# EAGLE design TestBench_rev2 (EAGLE 6.1)
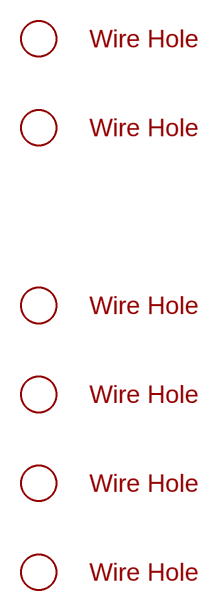
[diagram p0: schematic, sheet 1, part 1 of 2]
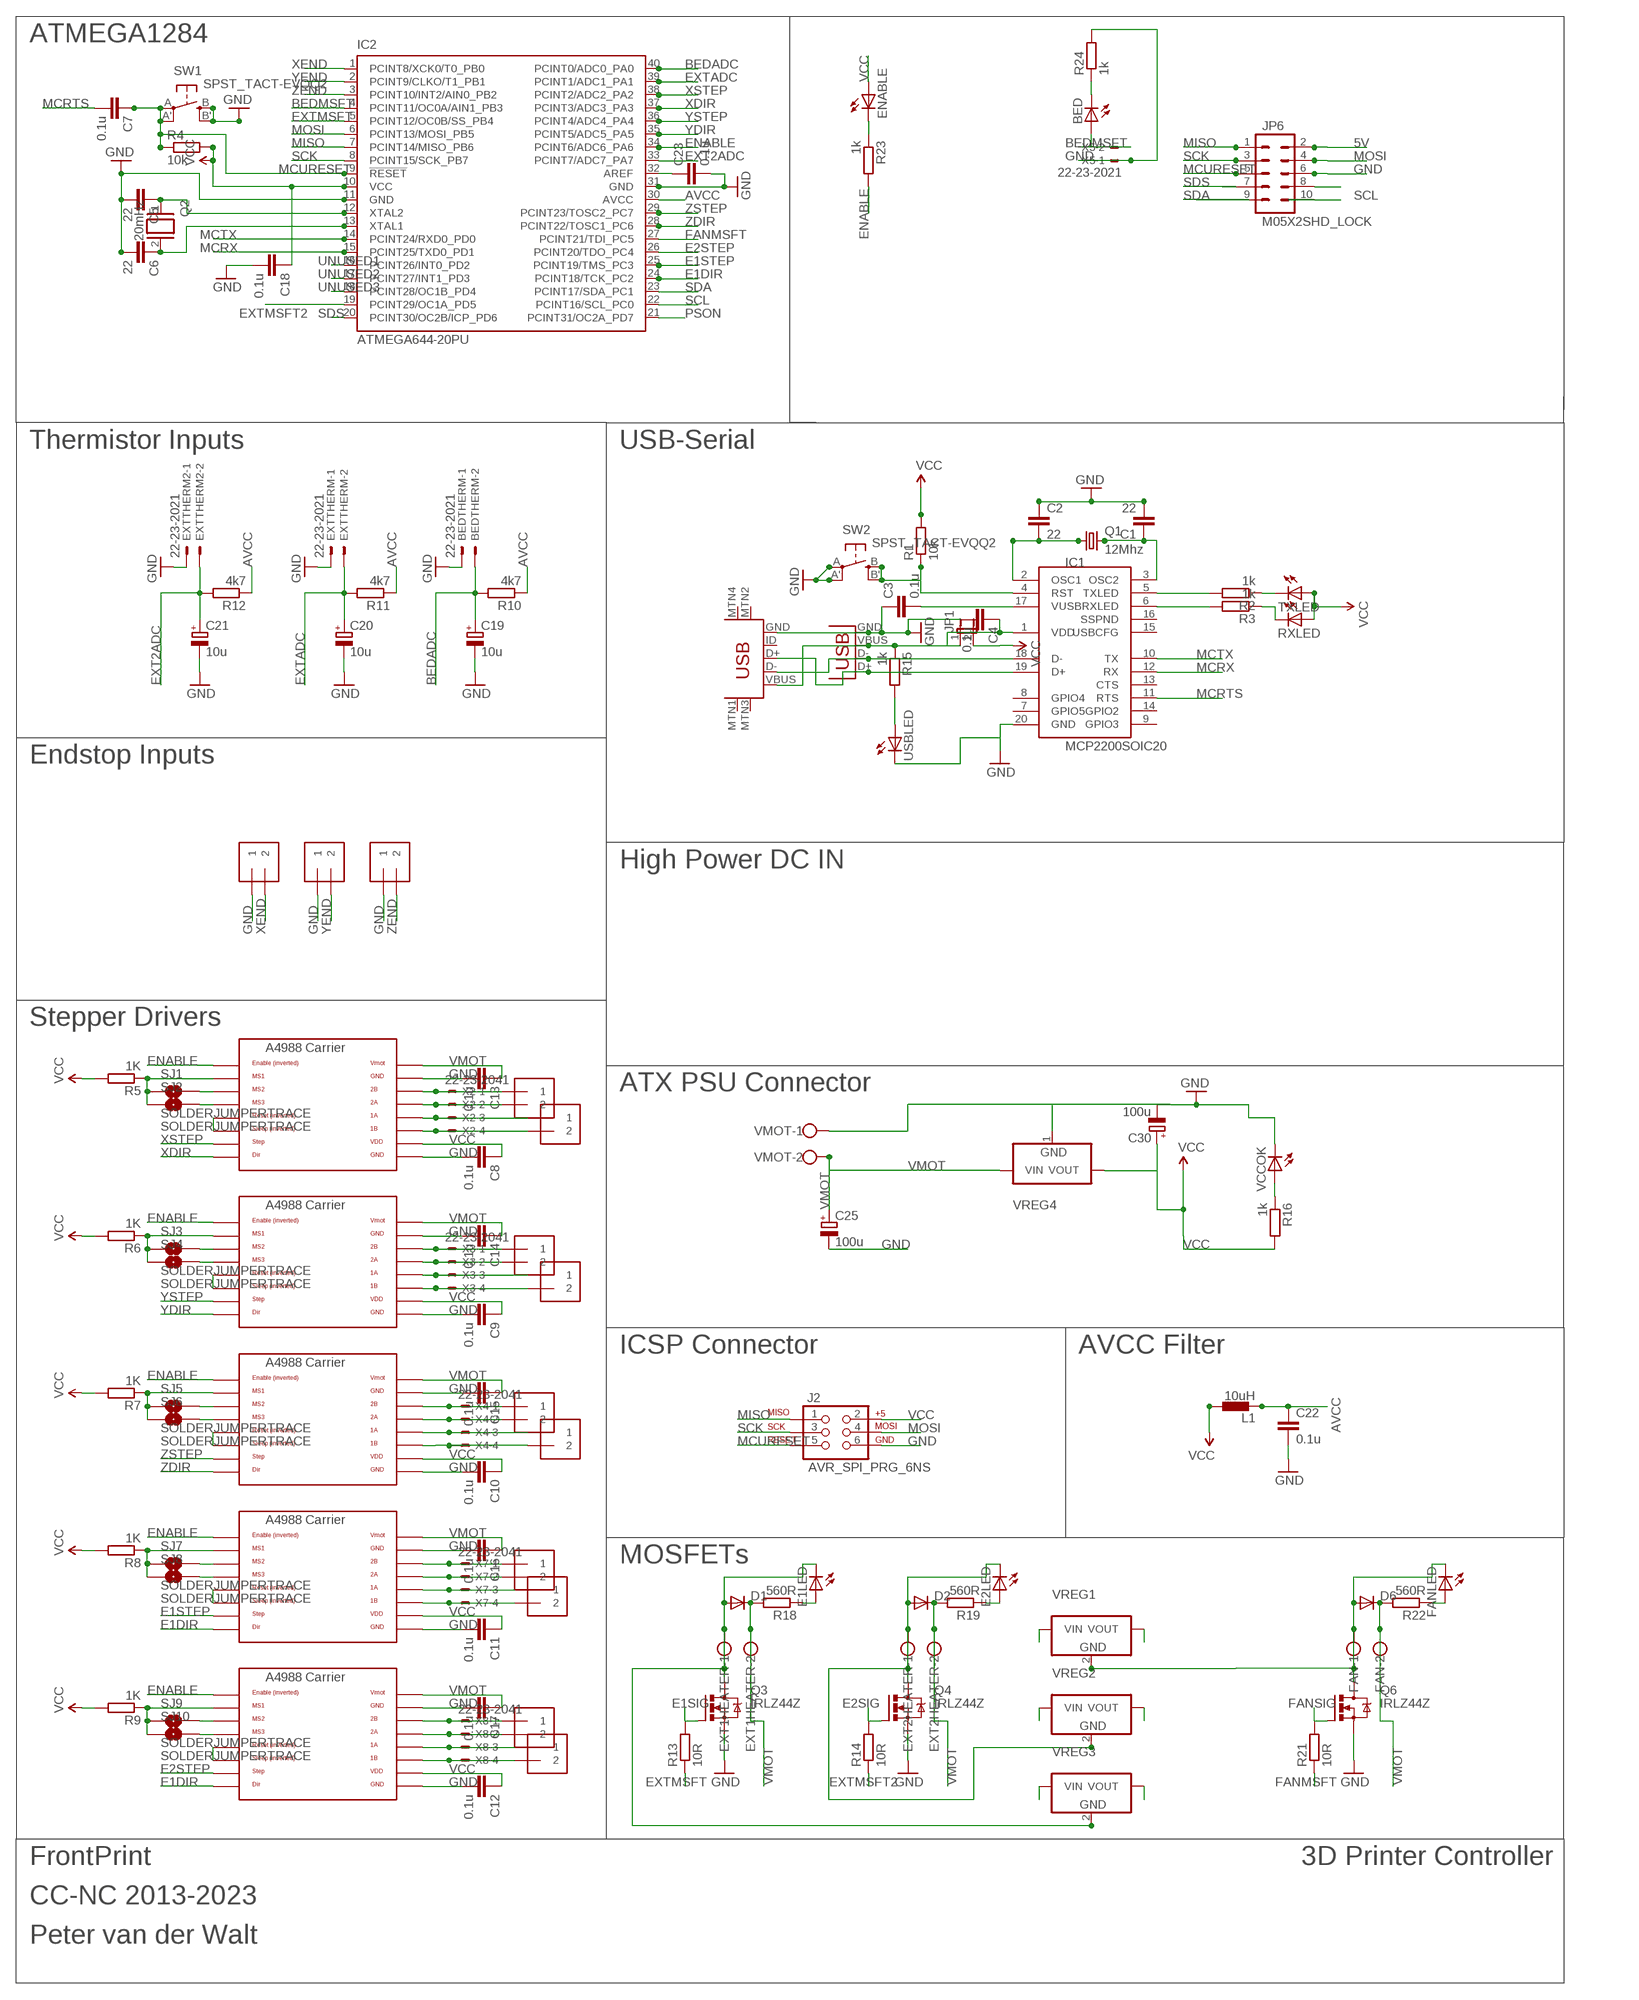
[diagram p1: schematic, sheet 1, part 2 of 2]

## Parts
BED  LEDSMT1206  [1206]
BEDTHERM  22-23-2021  [22-23-2021]
C1  22  CAP1206  [1206]
C2  22  CAP1206  [1206]
C3  0.1u  CAP1206  [1206]
C4  0.1u  CAP1206  [1206]
C5  22  CAPKIT  [CAP-PTH-SMALL-KIT]
C6  22  CAPKIT  [CAP-PTH-SMALL-KIT]
C7  0.1u  CAP1206  [1206]
C8  0.1u  CAP1206  [1206]
C9  0.1u  CAP1206  [1206]
C10  0.1u  CAP1206  [1206]
C11  0.1u  CAP1206  [1206]
C12  0.1u  CAP1206  [1206]
C13  0.1u  CAP1206  [1206]
C14  0.1u  CAP1206  [1206]
C15  0.1u  CAP1206  [1206]
C16  0.1u  CAP1206  [1206]
C17  0.1u  CAP1206  [1206]
C18  0.1u  CAP1206  [1206]
C19  10u  CPOL-EUE2.5-5  [E2,5-5]
C20  10u  CPOL-EUE2.5-5  [E2,5-5]
C21  10u  CPOL-EUE2.5-5  [E2,5-5]
C22  0.1u  CAP1206  [1206]
C23  0.1u  CAP1206  [1206]
C25  100u  CPOL-EUE5-8.5  [E5-8,5]
C30  100u  CPOL-EUE5-8.5  [E5-8,5]
D1  DIODE1N4148  [DIODE-1N4148]
D2  DIODE1N4148  [DIODE-1N4148]
D6  DIODE1N4148  [DIODE-1N4148]
E1LED  LEDSMT1206  [1206]
E1MOT1  1X2-3.5MM  [1X2-3.5MM]
E1MOT2  1X2-3.5MM  [1X2-3.5MM]
E2LED  LEDSMT1206  [1206]
E2MOT1  1X2-3.5MM  [1X2-3.5MM]
E2MOT2  1X2-3.5MM  [1X2-3.5MM]
ENABLE  LEDSMT1206  [1206]
EPOLOLU  POLOLU_A4983CARRIER  [A4988BREAKOUT]
EPOLOLU2  POLOLU_A4983CARRIER  [A4988BREAKOUT]
EXT1HEATER  W237-102  [W237-102]
EXT2HEATER  W237-102  [W237-102]
EXTTHERM  22-23-2021  [22-23-2021]
EXTTHERM2  22-23-2021  [22-23-2021]
FAN  W237-102  [W237-102]
FANLED  LEDSMT1206  [1206]
IC1  MCP2200SOIC20  [SOIC20]
IC2  ATMEGA644-20PU  [DIL40]
J2  AVR_SPI_PRG_6NS  [2X3-NS]
JP1  JUMPER-2PTH_LOCK  [1X02_LOCK]
JP6  M05X2SHD_LOCK  [2X5-SHROUDED_LOCK]
L1  10uH  BL01RN1A  [BL01RN1A]
Q1  12Mhz  CRYSTALHC49UP  [HC49UP]
Q2  20mHz  XTAL/S  [QS]
Q3  IRLZ44Z  [TO220BH]
Q4  IRLZ44Z  [TO220BH]
Q6  IRLZ44Z  [TO220BH]
R1  10k  R-EU_M1206  [M1206]
R2  1k  R-EU_M1206  [M1206]
R3  1k  R-EU_M1206  [M1206]
R4  10k  R-EU_M1206  [M1206]
R5  1K  R-EU_M1206  [M1206]
R6  1K  R-EU_M1206  [M1206]
R7  1K  R-EU_M1206  [M1206]
R8  1K  R-EU_M1206  [M1206]
R9  1K  R-EU_M1206  [M1206]
R10  4k7  R-EU_M1206  [M1206]
R11  4k7  R-EU_M1206  [M1206]
R12  4k7  R-EU_M1206  [M1206]
R13  10R  R-EU_M1206  [M1206]
R14  10R  R-EU_M1206  [M1206]
R15  1k  R-EU_M1206  [M1206]
R16  1k  R-EU_M1206  [M1206]
R18  560R  R-EU_M1206  [M1206]
R19  560R  R-EU_M1206  [M1206]
R21  10R  R-EU_M1206  [M1206]
R22  560R  R-EU_M1206  [M1206]
R23  1k  R-EU_M1206  [M1206]
R24  1k  R-EU_M1206  [M1206]
RXLED  LEDSMT1206  [1206]
SJ1  SOLDERJUMPERTRACE  [SJ_2S-TRACE]
SJ2  SOLDERJUMPERTRACE  [SJ_2S-TRACE]
SJ3  SOLDERJUMPERTRACE  [SJ_2S-TRACE]
SJ4  SOLDERJUMPERTRACE  [SJ_2S-TRACE]
SJ5  SOLDERJUMPERTRACE  [SJ_2S-TRACE]
SJ6  SOLDERJUMPERTRACE  [SJ_2S-TRACE]
SJ7  SOLDERJUMPERTRACE  [SJ_2S-TRACE]
SJ8  SOLDERJUMPERTRACE  [SJ_2S-TRACE]
SJ9  SOLDERJUMPERTRACE  [SJ_2S-TRACE]
SJ10  SOLDERJUMPERTRACE  [SJ_2S-TRACE]
SW1  SPST_TACT-EVQQ2  [EVQ-Q2]
SW2  SPST_TACT-EVQQ2  [EVQ-Q2]
TXLED  LEDSMT1206  [1206]
U$1  3MMHOLE  [3MMHOLE]
U$2  USB-MINIB-5PIN  [USB-MINIB]
U$3  3MMHOLE  [3MMHOLE]
U$5  3MMHOLE  [3MMHOLE]
U$6  3MMHOLE  [3MMHOLE]
U$7  3MMHOLE  [3MMHOLE]
U$8  3MMHOLE  [3MMHOLE]
USBLED  LEDSMT1206  [1206]
VCCOK  LEDSMT1206  [1206]
VMOT  W237-102  [W237-102]
VREG1  VREG_3PINS-D2PAK  [D2PAK]
VREG2  VREG_3PINS-D2PAK  [D2PAK]
VREG3  VREG_3PINS-D2PAK  [D2PAK]
VREG4  VREG_3PINS-DPAK  [DPAK]
X1  USBPTH  [USB-B-PTH]
X2  22-23-2041  [22-23-2041]
X3  22-23-2041  [22-23-2041]
X4  22-23-2041  [22-23-2041]
X5  22-23-2021  [22-23-2021]
X7  22-23-2041  [22-23-2041]
X8  22-23-2041  [22-23-2041]
XEND  1X2-3.5MM  [1X2-3.5MM]
XMOT1  1X2-3.5MM  [1X2-3.5MM]
XMOT2  1X2-3.5MM  [1X2-3.5MM]
XPOLOLU  POLOLU_A4983CARRIER  [A4988BREAKOUT]
YEND  1X2-3.5MM  [1X2-3.5MM]
YMOT1  1X2-3.5MM  [1X2-3.5MM]
YMOT2  1X2-3.5MM  [1X2-3.5MM]
YPOLOLU  POLOLU_A4983CARRIER  [A4988BREAKOUT]
ZEND  1X2-3.5MM  [1X2-3.5MM]
ZMOT1  1X2-3.5MM  [1X2-3.5MM]
ZMOT2  1X2-3.5MM  [1X2-3.5MM]
ZPOLOLU  POLOLU_A4983CARRIER  [A4988BREAKOUT]

## Nets
5V: JP6.2
AVCC: C22.1 IC2.30(AVCC) L1.1 R10.1 R11.1 R12.1
BEDADC: BEDTHERM.2 C19.+ IC2.40(PCINT0/ADC0_PA0) R10.2
BEDMSFT: BED.A IC2.4(PCINT11/OC0A/AIN1_PB3) X5.2
E1DIR: EPOLOLU2.DIR EPOLOLU.DIR IC2.24(PCINT18/TCK_PC2)
E1SIG: Q3.G R13.2 VREG3.1(VIN)
E1STEP: EPOLOLU.STEP IC2.25(PCINT19/TMS_PC3)
E2SIG: Q4.G R14.2 VREG2.1(VIN)
E2STEP: EPOLOLU2.STEP IC2.26(PCINT20/TDO_PC4)
ENABLE: EPOLOLU2.EN EPOLOLU.EN IC2.34(PCINT6/ADC6_PA6) R23.2 XPOLOLU.EN YPOLOLU.EN ZPOLOLU.EN
EXT2ADC: C21.+ EXTTHERM2.2 IC2.33(PCINT7/ADC7_PA7) R12.2
EXTADC: C20.+ EXTTHERM.2 IC2.39(PCINT1/ADC1_PA1) R11.2
EXTMSFT: IC2.5(PCINT12/OC0B/SS_PB4) R13.1
EXTMSFT2: IC2.19(PCINT29/OC1A_PD5) R14.1
FANMSFT: IC2.27(PCINT21/TDI_PC5) R21.1
FANSIG: Q6.G R21.2 VREG1.1(VIN)
GND: BEDTHERM.1 C1.2 C2.1 C3.1 C4.2 C5.2 C6.2 C8.2 C9.2 C10.2 C11.2 C12.2 C13.2 C14.2 C15.2 C16.2 C17.2 C18.2 C19.- C20.- C21.- C22.2 C23.2 C25.- C30.- EPOLOLU2.GND EPOLOLU2.GND@0(GND) EPOLOLU.GND EPOLOLU.GND@0(GND) EXTTHERM2.1 EXTTHERM.1 IC1.20(GND) IC2.11(GND) IC2.31(GND) J2.6 JP6.6 Q3.S Q4.S Q6.S R24.2 SW1.B'(S1) SW1.B(S) SW2.A'(P1) SW2.A(P) U$2.GND USBLED.C VCCOK.C VMOT.1 VREG1.3(VOUT) VREG2.3(VOUT) VREG3.3(VOUT) VREG4.1(GND) X1.GND X5.1 XEND.1 XPOLOLU.GND XPOLOLU.GND@0(GND) YEND.1 YPOLOLU.GND YPOLOLU.GND@0(GND) ZEND.1 ZPOLOLU.GND ZPOLOLU.GND@0(GND)
MCRTS: C7.2 IC1.11(RTS)
MCRX: IC1.12(RX) IC2.15(PCINT25/TXD0_PD1)
MCTX: IC1.10(TX) IC2.14(PCINT24/RXD0_PD0)
MCURESET: C7.1 IC2.9(!RESET) J2.5 JP6.5 R4.1 SW1.A'(P1) SW1.A(P)
MISO: IC2.7(PCINT14/MISO_PB6) J2.1 JP6.1
MOSI: IC2.6(PCINT13/MOSI_PB5) J2.4 JP6.4
N$1: C2.2 IC1.2(OSC1) Q1.1
N$2: C1.1 IC1.3(OSC2) Q1.2
N$3: IC1.5(TXLED) R2.2
N$4: IC1.18(D-) U$2.D- X1.D-
N$5: IC1.19(D+) U$2.D+ X1.D+
N$6: IC1.6(RXLED) R3.2
N$7: C3.2 IC1.17(VUSB)
N$9: R2.1 TXLED.C
N$10: R3.1 RXLED.C
N$11: C5.1 IC2.12(XTAL2) Q2.1
N$12: C6.1 IC2.13(XTAL1) Q2.2
N$13: IC1.4(RST) R1.1 SW2.B'(S1) SW2.B(S)
N$14: R7.1 SJ5.1 SJ6.1 ZPOLOLU.MS1
N$15: SJ6.2 ZPOLOLU.MS3
N$16: SJ5.2 ZPOLOLU.MS2
N$17: EPOLOLU.MS2 SJ7.2
N$18: EPOLOLU.MS3 SJ8.2
N$19: EPOLOLU.MS1 R8.1 SJ7.1 SJ8.1
N$20: SJ3.2 YPOLOLU.MS2
N$21: SJ4.2 YPOLOLU.MS3
N$22: R6.1 SJ3.1 SJ4.1 YPOLOLU.MS1
N$23: SJ1.2 XPOLOLU.MS2
N$24: SJ2.2 XPOLOLU.MS3
N$25: R5.1 SJ1.1 SJ2.1 XPOLOLU.MS1
N$26: XPOLOLU.RST XPOLOLU.SLP(SLEEP)
N$27: YPOLOLU.RST YPOLOLU.SLP(SLEEP)
N$28: ZPOLOLU.RST ZPOLOLU.SLP(SLEEP)
N$29: EPOLOLU.RST EPOLOLU.SLP(SLEEP)
N$30: E1MOT1.1 EPOLOLU.2B X7.1
N$31: E1MOT1.2 EPOLOLU.2A X7.2
N$32: E1MOT2.1 EPOLOLU.1A X7.3
N$33: E1MOT2.2 EPOLOLU.1B X7.4
N$34: X4.4 ZMOT2.2 ZPOLOLU.1B
N$35: X4.3 ZMOT2.1 ZPOLOLU.1A
N$36: X4.2 ZMOT1.2 ZPOLOLU.2A
N$37: X4.1 ZMOT1.1 ZPOLOLU.2B
N$38: X3.4 YMOT2.2 YPOLOLU.1B
N$39: X3.3 YMOT2.1 YPOLOLU.1A
N$40: X3.2 YMOT1.2 YPOLOLU.2A
N$41: X3.1 YMOT1.1 YPOLOLU.2B
N$42: X2.4 XMOT2.2 XPOLOLU.1B
N$43: X2.3 XMOT2.1 XPOLOLU.1A
N$44: X2.2 XMOT1.2 XPOLOLU.2A
N$45: X2.1 XMOT1.1 XPOLOLU.2B
N$46: EPOLOLU2.MS2 SJ9.2
N$47: EPOLOLU2.MS3 SJ10.2
N$48: EPOLOLU2.MS1 R9.1 SJ9.1 SJ10.1
N$49: EPOLOLU2.RST EPOLOLU2.SLP(SLEEP)
N$50: E2MOT1.1 EPOLOLU2.2B X8.1
N$51: E2MOT1.2 EPOLOLU2.2A X8.2
N$52: E2MOT2.1 EPOLOLU2.1A X8.3
N$53: E2MOT2.2 EPOLOLU2.1B X8.4
N$54: C23.1 IC2.32(AREF)
N$55: D1.A E1LED.C EXT1HEATER.1 Q3.D VREG3.2(GND)
N$56: D2.A E2LED.C EXT2HEATER.1 Q4.D VREG2.2(GND)
N$58: C4.1 IC1.1(VDD) JP1.1 R15.1 U$2.VBUS X1.VBUS
N$59: BED.C R24.1
N$61: E1LED.A R18.1
N$64: R16.1 VCCOK.A
N$66: E2LED.A R19.1
N$67: D6.A FAN.1 FANLED.C Q6.D VREG1.2(GND)
N$68: R15.2 USBLED.A
N$69: FANLED.A R22.1
N$71: ENABLE.C R23.1
N$73: JP6.8
PSON: IC2.21(PCINT31/OC2A_PD7)
SCK: IC2.8(PCINT15/SCK_PB7) J2.3 JP6.3
SCL: IC2.22(PCINT16/SCL_PC0) JP6.10
SDA: IC2.23(PCINT17/SDA_PC1) JP6.9
SDS: IC2.20(PCINT30/OC2B/ICP_PD6) JP6.7
UNUSED1: IC2.16(PCINT26/INT0_PD2)
UNUSED2: IC2.17(PCINT27/INT1_PD3)
UNUSED3: IC2.18(PCINT28/OC1B_PD4)
VCC: C8.1 C9.1 C10.1 C11.1 C12.1 C18.1 C30.+ ENABLE.A EPOLOLU2.VDD EPOLOLU.VDD IC2.10(VCC) J2.2 JP1.2 L1.2 R1.2 R4.2 R5.2 R6.2 R7.2 R8.2 R9.2 R16.2 RXLED.A TXLED.A VREG4.2(VOUT) XPOLOLU.VDD YPOLOLU.VDD ZPOLOLU.VDD
VMOT: C13.1 C14.1 C15.1 C16.1 C17.1 C25.+ D1.C D2.C D6.C EPOLOLU2.VMOT EPOLOLU.VMOT EXT1HEATER.2 EXT2HEATER.2 FAN.2 R18.2 R19.2 R22.2 VMOT.2 VREG4.3(VIN) XPOLOLU.VMOT YPOLOLU.VMOT ZPOLOLU.VMOT
XDIR: IC2.37(PCINT3/ADC3_PA3) XPOLOLU.DIR
XEND: IC2.1(PCINT8/XCK0/T0_PB0) XEND.2
XSTEP: IC2.38(PCINT2/ADC2_PA2) XPOLOLU.STEP
YDIR: IC2.35(PCINT5/ADC5_PA5) YPOLOLU.DIR
YEND: IC2.2(PCINT9/CLKO/T1_PB1) YEND.2
YSTEP: IC2.36(PCINT4/ADC4_PA4) YPOLOLU.STEP
ZDIR: IC2.28(PCINT22/TOSC1_PC6) ZPOLOLU.DIR
ZEND: IC2.3(PCINT10/INT2/AIN0_PB2) ZEND.2
ZSTEP: IC2.29(PCINT23/TOSC2_PC7) ZPOLOLU.STEP
Unconnected: IC1.7(GPIO5) IC1.8(GPIO4) IC1.9(GPIO3) IC1.13(CTS) IC1.14(GPIO2) IC1.15(USBCFG) IC1.16(SSPND) U$2.ID U$2.MTN1(MTN2) U$2.MTN2(MTN3) U$2.MTN3(MTN1) U$2.MTN4

## Notes on the sheet
- ATMEGA1284
- Thermistor Inputs | USB-Serial
- Endstop Inputs
- High Power DC IN
- Stepper Drivers
- ATX PSU Connector
- ICSP Connector | AVCC Filter
- MOSFETs
- FrontPrint | 3D Printer Controller
- CC-NC 2013-2023
- Peter van der Walt

## Library data of the parts
BED E1LED E2LED ENABLE FANLED RXLED TXLED USBLED VCCOK = led:LED: LED OSRAM: - CHIPLED LG R971, LG N971, LY N971, LG Q971, LY Q971, LO R971, LY R971 LH N974, LH R974 LS Q976, LO Q976, LY Q976 LO Q996 - Hyper CHIPLED LW Q18S LB Q993, LB Q99A, LB R99A - SideLED LS A670, LO A670, LY A670, LG A670, LP A670 LB A673, LV A673, LT A673, LW A673 LH A674 LY A675 LS A676, LA A676, LO A676, LY A676, LW A676 LS A679, LY A679, LG A679 - Hyper Micro SIDELED® LS Y876, LA Y876, LO Y876, LY Y876 LT Y87S - SmartLED LW L88C, LW L88S LB L89C, LB L89S, LG L890 LS L89K, LO L89K, LY L89K LS L896, LA L896, LO L896, LY L896 - TOPLED LS T670, LO T670, LY T670, LG T670, LP T670 LSG T670, LSP T670, LSY T670, LOP T670, LYG T670 LG T671, LOG T671, LSG T671 LB T673, LV T673, LT T673, LW T673 LH T674 LS T676, LA T676, LO T676, LY T676, LB T676, LH T676, LSB T676, LW T676 LB T67C, LV T67C, LT T67C, LS T67K, LO T67K, LY T67K, LW E67C LS E67B, LA E67B, LO E67B, LY E67B, LB E67C, LV E67C, LT E67C LW T67C LS T679, LY T679, LG T679 LS T770, LO T770, LY T770, LG T770, LP T770 LB T773, LV T773, LT T773, LW T773 LH T774 LS E675, LA E675, LY E675, LS T675 LS T776, LA T776, LO T776, LY T776, LB T776 LHGB T686 LT T68C, LB T68C - Hyper Mini TOPLED® LB M676 - Mini TOPLED Santana® LG M470 LS M47K, LO M47K, LY M47K Source: http://www.osram.convergy.de LUXEON: - LUMILED® LXK2-PW12-R00, LXK2-PW12-S00, LXK2-PW14-U00, LXK2-PW14-V00 LXK2-PM12-R00, LXK2-PM12-S00, LXK2-PM14-U00 LXK2-PE12-Q00, LXK2-PE12-R00, LXK2-PE12-S00, LXK2-PE14-T00, LXK2-PE14-U00 LXK2-PB12-K00, LXK2-PB12-L00, LXK2-PB12-M00, LXK2-PB14-N00, LXK2-PB14-P00, LXK2-PB14-Q00 LXK2-PR12-L00, LXK2-PR12-M00, LXK2-PR14-Q00, LXK2-PR14-R00 LXK2-PD12-Q00, LXK2-PD12-R00, LXK2-PD12-S00 LXK2-PH12-R00, LXK2-PH12-S00 LXK2-PL12-P00, LXK2-PL12-Q00, LXK2-PL12-R00 Source: www.luxeon.com KINGBRIGHT: KA-3528ASYC Source: www.kingbright.com
BEDTHERM EXTTHERM EXTTHERM2 X5 = con-molex:22-23-2021: .100" (2.54mm) Center Header - 2 Pin; MF: MOLEX; MPN: 22-23-2021; OC_FARNELL: 1462926; OC_NEWARK: 25C3832
C1-C18 C22 C23 = SparkFun-Passives:CAP: Capacitor Standard 0603 ceramic capacitor, and 0.1" leaded capacitor.
C19-C21 C25 C30 = rcl:CPOL-EU: POLARIZED CAPACITOR, European symbol
D1 D2 D6 = SparkFun-DiscreteSemi:DIODE: Diode These are standard reverse protection diodes and small signal diodes. SMA package can handle up to about 1A. SOD-323 can handle about 200mA. What the SOD-323 package when ordering, there are some mfgs out there that are 5-pin packages.
E1MOT1 E1MOT2 E2MOT1 E2MOT2 XEND XMOT1 XMOT2 YEND YMOT1 YMOT2 ZEND ZMOT1 ZMOT2 = adafruit:1X2: 3.5mm Terminal block http://www.ladyada.net/library/pcb/eaglelibrary.html
EPOLOLU EPOLOLU2 XPOLOLU YPOLOLU ZPOLOLU = RepRapjr:POLOLU_A4983CARRIER
EXT1HEATER EXT2HEATER FAN VMOT = con-wago-500:W237-102: WAGO SCREW CLAMP; MPN: 237-102; OC_FARNELL: unknown; OC_NEWARK: 70K9898
IC1 = microchip-update-2:MCP2200: USB 2.0 to UART Protocol Converter with GPIO
IC2 = atmel:ATMEGA644-*PU: 8-bit Microcontroller with 64K Bytes In-System Programmable Flash Auto generated by make-symbol-device-package-bsdl.ulp Rev. 34 Source: http://www.atmel.com/dyn/resources/prod_documents/doc2593.pdf; MPN: ATMEGA644-20PU; OC_FARNELL: 1288340; OC_NEWARK: 23M5060
J2 = SparkFun-Connectors:AVR_SPI_PRG_6: AVR ISP 6 Pin This is the reduced ISP connector for AVR programming. Common on Arduino. This footprint will take up less PCB space and can be used with a 10-pin to 6-pin adapter such as SKU: BOB-08508
JP1 = SparkFun-Passives:JUMPER-2: Jumper Basic 0.1" spaced jumper. Use with breakaway headers.
JP6 = SparkFun-Connectors:M05X2: Header 5x2 Standard 10-pin dual row 0.1" header. Commonly used with AVR-ISP. Use with Spark Fun Electronics SKU: PRT-00778
L1 = inductors:BL0: Noise Suppression Products/EMI Suppression Filters, Lead EMIFIL(R) Inductor Type Source: http://www.murata.com .. BL01RN1_DS.pdf
Q1 = adafruit:CRYSTAL: CRYSTAL; OC_FARNELL: unknown; OC_NEWARK: unknown
Q2 = special:XTAL/S: CRYSTAL
Q3 Q4 Q6 = transistor-power:IRLZ44Z: N-Channel HEXFET® Power MOSFET Logic Level AUTOMOTIVE MOSFET Source: http://www.irf.com/product-info/datasheets/data/irlz44zpbf.pdf
R1-R16 R18 R19 R21-R24 = resistor:R-EU_: RESISTOR, European symbol
SJ1-SJ10 = SparkFun-Passives:SOLDERJUMPER: Solder Jumper Standard SMD solder jumper. Used to automate production. Two varients : Normally Open and Normally Closed are the same, but have different paste layers. NC will have a large amount of paste and should jumper during reflow.
SW1 SW2 = adafruit:SPST_TACT: SMT 6mm switch, EVQQ2 series http://www.ladyada.net/library/eagle
U$1 U$3 U$5-U$8 = reprap:3MMHOLE
U$2 = SparkFun-Connectors:USB-MINIB: Mini-USB "B" connector with 5th pin broken out. Created new symbol breaking out 5th "ID" pin in mini/micro USB connector spec. See: http://en.wikipedia.org/wiki/Mini_usb#Cables. Uses same footprint as 4-pin symbol. Also added pins to connect to mounting / shield pads if required (probably not generally needed as signals aren't shielded once they leave the connector).
VREG1-VREG4 = dp_devices:VREG_3PINS: Various 3 pin voltage regulators in different packages Double check the right pinout for the right part
X1 = SparkFun-Connectors:USB: USB Connectors USB-B-PTH is fully proven SKU : PRT-00139 USB-miniB is fully proven SKU : PRT-00587 USB-A-PCB is untested. USB-A-H is throughly reviewed, but untested. Spark Fun Electronics SKU : PRT-00437 USB-B-SMT is throughly reviewed, but untested. Needs silkscreen touching up. USB-A-S has not been used/tested USB-MB-H has not been used/tested
X2-X4 X7 X8 = con-molex:22-23-2041: .100" (2.54mm) Center Header - 4 Pin; MF: MOLEX; MPN: 22-23-2041; OC_FARNELL: 1462920; OC_NEWARK: 38C0355

## Board
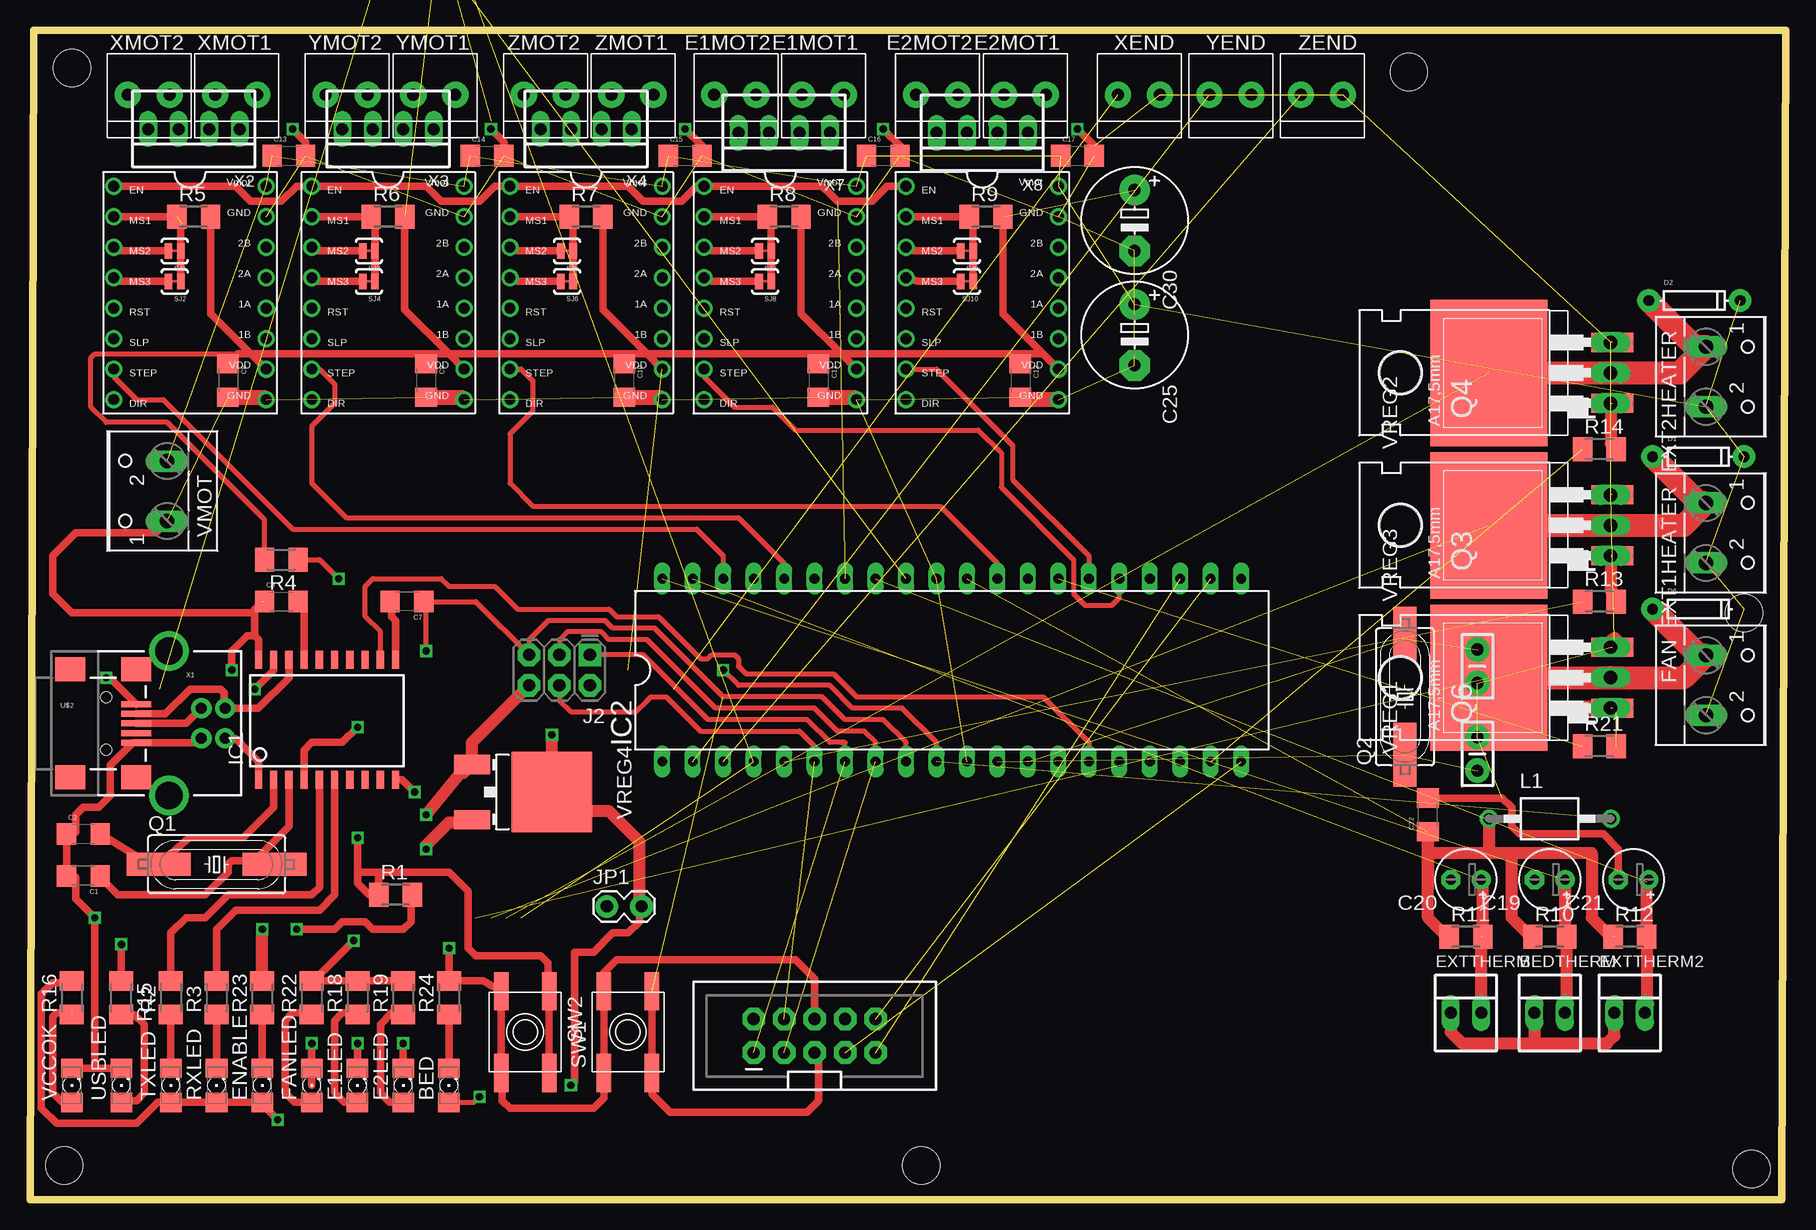
[diagram p2: board, top side]
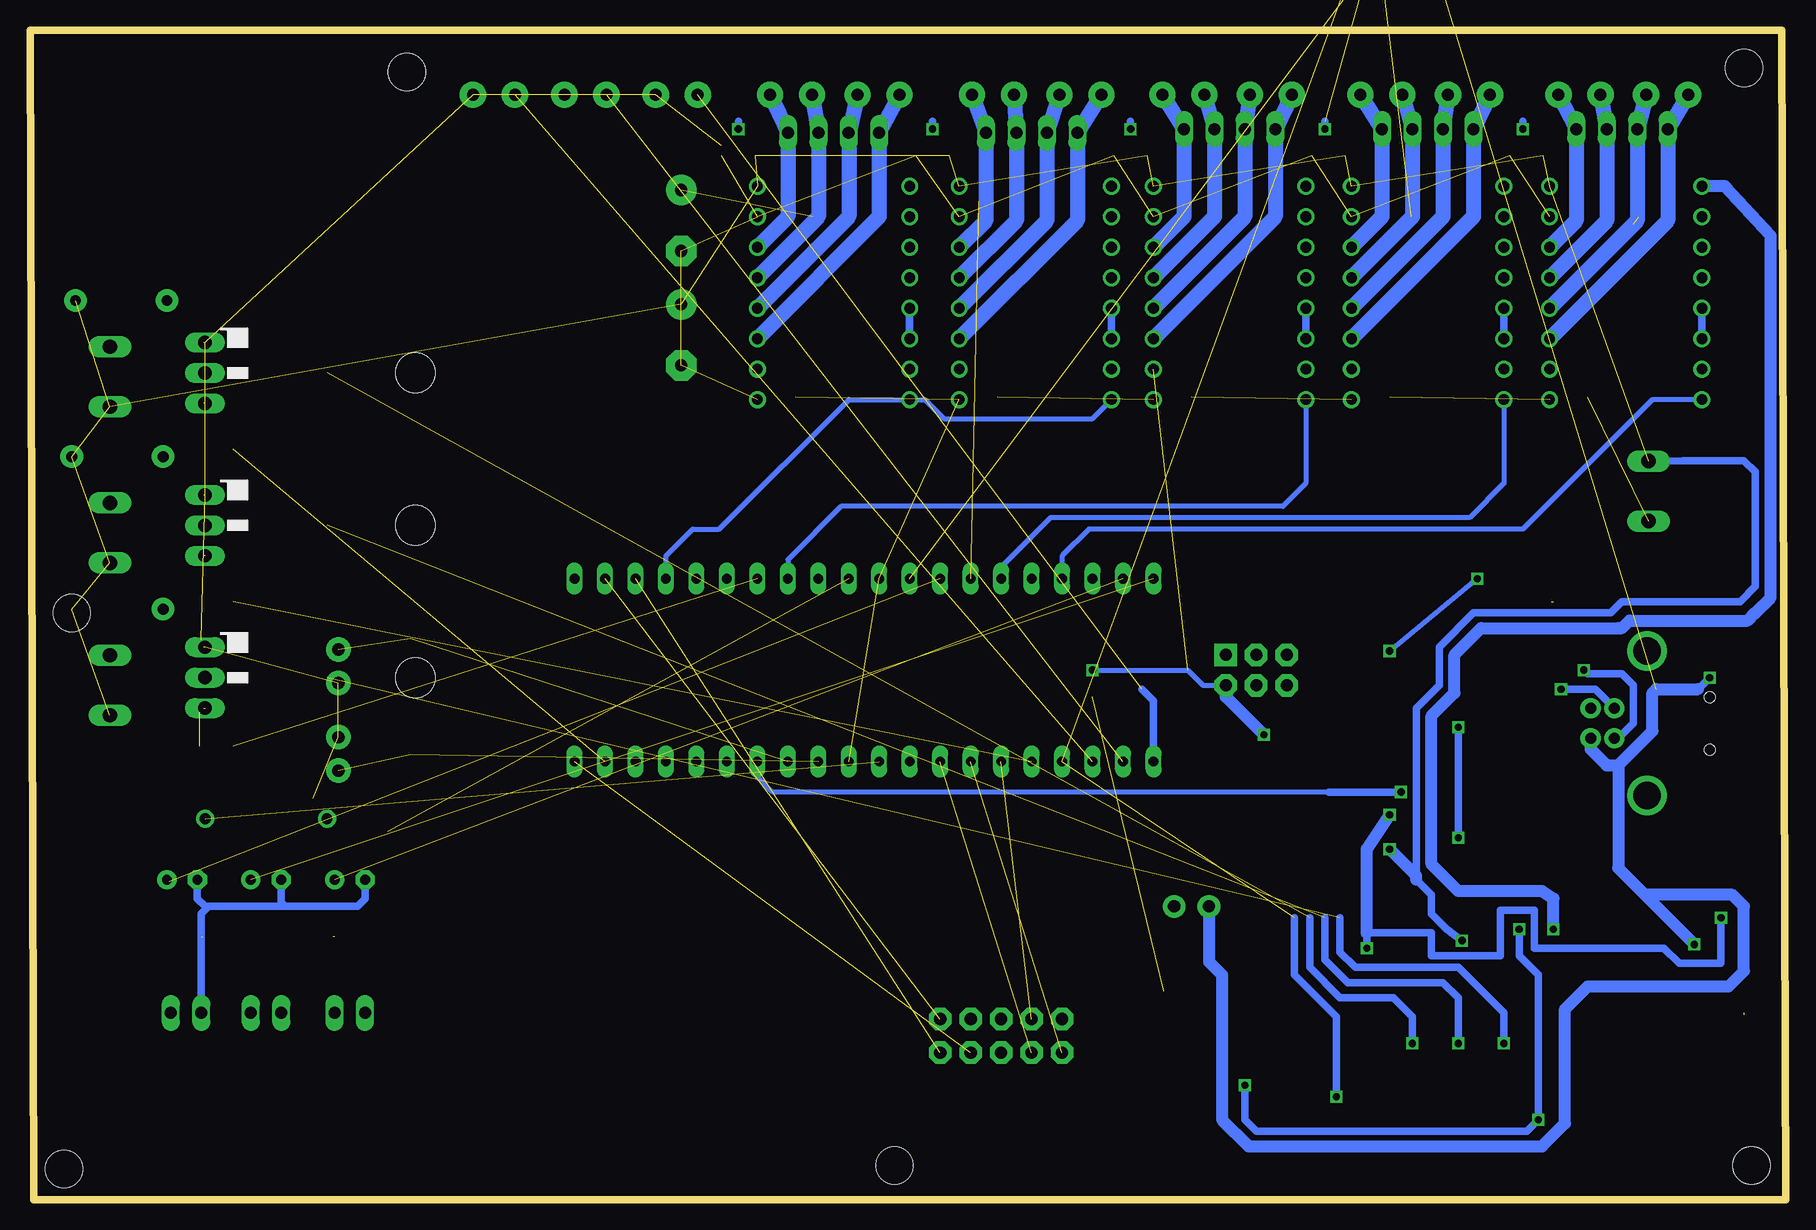
[diagram p3: board, bottom side, seen from below]

Size 146.35 x 97.47 mm. Coordinates in mm from the lower left corner, seen from the top.
Outline: 146.35,97.46 146.04,0 0,0 0.32,97.46 146.35,97.46
Outline: 146.35,97.46 100.65,97.47
Copper layers (1*16): Top 0.035mm / dielectric 1.5mm / Bottom 0.035mm
Design rules: minimum track width 10mil, minimum drill 24mil, track to track 8mil, track to pad 8mil, pad to pad 8mil, via to via 8mil, smd to smd 8mil, copper to edge 40mil, drill to drill 8mil, minimum pad ring 10mil, minimum via ring 8mil, stop-mask expansion 4mil, vias tented up to drill 0mil, thermal gap 10mil

### Footprints (pad centres in the part's own frame; a part is rotated, then mirrored left to right if it is on the bottom)
1206 = smd 1.6 x 1.803: A -1.422,0; C 1.422,0
22-23-2021 = drill 1 long: 1 -1.27,0; 2 1.27,0
1206' = smd 1.6 x 1.8: 1 -1.4,0; 2 1.4,0
CAP-PTH-SMALL-KIT = drill 1.016 pad 2.032: 1 -1.397,0; 2 1.397,0
E2,5-5 = drill 0.813 pad 1.6: + -1.27,0 | drill 0.813 pad 1.6 octagon: - 1.27,0
E5-8,5 = drill 1.016 pad 2.54: + -2.54,0 | drill 1.016 pad 2.54 octagon: - 2.54,0
DIODE-1N4148 = drill 0.9 pad 1.88: A -3.81,0; C 3.81,0
1X2-3.5MM = drill 1 pad 2.184: 1 1.8,0; 2 -1.7,0
A4988BREAKOUT = drill 0.9: 1A 8.89,1.27; 1B 11.43,1.27; 2A 6.35,1.27; 2B 3.81,1.27; DIR 16.51,-11.43; EN -1.27,-11.43; GND 16.51,1.27; GND@0 1.27,1.27; MS1 1.27,-11.43; MS2 3.81,-11.43; MS3 6.35,-11.43; RST 8.89,-11.43; SLP 11.43,-11.43; STEP 13.97,-11.43; VDD 13.97,1.27; VMOT -1.27,1.27
W237-102 = drill 1.194 long: 1 -2.5,-1.27; 2 2.5,-1.27
SOIC20 = smd 0.6 x 1.5: 1 -5.715,-5; 2 -4.445,-5; 3 -3.175,-5; 4 -1.905,-5; 5 -0.635,-5; 6 0.635,-5; 7 1.905,-5; 8 3.175,-5; 9 4.445,-5; 10 5.715,-5; 11 5.715,5; 12 4.445,5; 13 3.175,5; 14 1.905,5; 15 0.635,5; 16 -0.635,5; 17 -1.905,5; 18 -3.175,5; 19 -4.445,5; 20 -5.715,5
DIL40 = drill 0.813 long: 1 -24.13,-7.62; 2 -21.59,-7.62; 3 -19.05,-7.62; 4 -16.51,-7.62; 5 -13.97,-7.62; 6 -11.43,-7.62; 7 -8.89,-7.62; 8 -6.35,-7.62; 9 -3.81,-7.62; 10 -1.27,-7.62; 11 1.27,-7.62; 12 3.81,-7.62; 13 6.35,-7.62; 14 8.89,-7.62; 15 11.43,-7.62; 16 13.97,-7.62; 17 16.51,-7.62; 18 19.05,-7.62; 19 21.59,-7.62; 20 24.13,-7.62; 21 24.13,7.62; 22 21.59,7.62; 23 19.05,7.62; 24 16.51,7.62; 25 13.97,7.62; 26 11.43,7.62; 27 8.89,7.62; 28 6.35,7.62; 29 3.81,7.62; 30 1.27,7.62; 31 -1.27,7.62; 32 -3.81,7.62; 33 -6.35,7.62; 34 -8.89,7.62; 35 -11.43,7.62; 36 -13.97,7.62; 37 -16.51,7.62; 38 -19.05,7.62; 39 -21.59,7.62; 40 -24.13,7.62
2X3-NS = drill 1.016 pad 1.88 square: 1 -2.54,-1.27 | drill 1.016 pad 1.88 octagon: 2 -2.54,1.27; 3 0,-1.27; 4 0,1.27; 5 2.54,-1.27; 6 2.54,1.27
1X02_LOCK = drill 1.016 pad 1.88: 1 -0.178,0; 2 2.718,0
2X5-SHROUDED_LOCK = drill 1.016 pad 1.88 octagon: 1 -1.397,5.08; 2 1.397,5.08; 3 -1.397,2.54; 4 1.397,2.54; 5 -1.397,0; 6 1.397,0; 7 -1.397,-2.54; 8 1.397,-2.54; 9 -1.397,-5.08; 10 1.397,-5.08
BL01RN1A = drill 0.9 pad 1.5: 1 -5.08,0; 2 5.08,0
HC49UP = smd 5.334 x 1.93: 1 -4.826,0; 2 4.826,0
TO220BH = drill 1.118 long: D 0,-6.35; G -2.54,-6.35; S 2.54,-6.35 | hole 3.302: 0,11.176
M1206 = smd 1.6 x 2: 1 -1.4,0; 2 1.4,0
SJ_2S-TRACE = smd 0.635 x 1.27: 1 -0.508,0; 2 0.508,0
EVQ-Q2 = smd 3.2 x 1.2: A -3.4,-2; A' 3.4,-2; B -3.4,2; B' 3.4,2
3MMHOLE = hole 3.1: 0,0
USB-MINIB = smd 2.5 x 0.5: D+ 2.5,0; D- 2.5,0.8; GND 2.5,-1.6; ID 2.5,-0.8; VBUS 2.5,1.6 | smd 2.5 x 2: MTN1 -3,4.5; MTN2 2.5,4.5; MTN3 -3,-4.5; MTN4 2.5,-4.5 | hole 0.9: 0,2.2; 0,-2.2
D2PAK = smd 1.6 x 3.5: 1 -2.54,-10.28; 3 2.54,-10.28 | smd 12.2 x 9.75: 2 0,0
DPAK = smd 1.6 x 3: 1 -2.3,-6.65; 3 2.3,-6.65 | smd 6.7 x 6.7: 2 0,0
USB-B-PTH = drill 0.914 pad 1.676: D+ 0,1.25; D- 1.981,1.25; GND 0,-1.25; VBUS 1.981,-1.25 | drill 2.286: S1 -2.718,-6.02; S2 -2.718,6.02
22-23-2041 = drill 1 long: 1 -3.81,0; 2 -1.27,0; 3 1.27,0; 4 3.81,0

### Placement (x,y rotation side)
BED  34.93,9.52 90 top
BEDTHERM  126.68,15.56 0 top
C1  22  [1206']  4.45,26.99 180 top
C2  22  [1206']  4.45,30.48 0 top
C3  0.1u  [1206']  20.95,49.85 0 top
C4  0.1u  [1206']  32.07,107.63 0 top  (outside the outline)
C5  120.65,37.15 90 top
C6  120.65,44.45 270 top
C7  0.1u  [1206']  31.43,49.85 180 top
C8  0.1u  [1206']  16.51,68.26 270 top
C9  0.1u  [1206']  33.02,68.26 270 top
C10  0.1u  [1206']  49.53,68.26 270 top
C11  0.1u  [1206']  65.72,68.26 270 top
C12  0.1u  [1206']  82.55,68.26 270 top
C13  0.1u  [1206']  21.59,86.99 0 top
C14  0.1u  [1206']  38.1,86.99 0 top
C15  0.1u  [1206']  54.61,86.99 0 top
C16  0.1u  [1206']  71.12,86.99 0 top
C17  0.1u  [1206']  87.31,86.99 0 top
C18  0.1u  [1206']  36.2,134.3 180 top  (outside the outline)
C19  126.68,26.67 180 top
C20  119.7,26.67 180 top
C21  133.67,26.67 180 top
C22  0.1u  [1206']  116.52,32.07 90 top
C23  0.1u  [1206']  7.3,138.11 270 top  (outside the outline)
C25  92.07,72.07 270 top
C30  92.07,81.6 270 top
D1  139.06,61.91 0 top
D2  138.75,74.93 0 top
D6  139.06,49.21 0 top
E1LED  27.3,9.52 90 top
E1MOT1  66.04,92.07 0 top
E1MOT2  58.74,92.07 0 top
E2LED  31.11,9.52 90 top
E2MOT1  82.87,92.07 0 top
E2MOT2  75.56,92.07 0 top
ENABLE  19.37,9.52 90 top
EPOLOLU  67.63,83.18 270 top
EPOLOLU2  84.45,83.18 270 top
EXT1HEATER  140.97,55.56 270 top
EXT2HEATER  140.97,68.58 270 top
EXTTHERM  119.7,15.56 0 top
EXTTHERM2  133.35,15.56 0 top
FAN  140.97,42.86 270 top
FANLED  23.49,9.52 90 top
IC1  24.77,40.01 0 top
IC2  76.83,44.13 0 top
J2  44.13,44.13 180 top
JP1  48.26,24.45 0 top
JP6  65.41,13.65 90 top
L1  126.68,31.75 0 top
Q1  15.56,27.94 0 top
Q2  20mHz  [HC49UP]  114.62,41.91 90 top
Q3  125.41,56.2 90 top
Q4  125.41,68.9 90 top
Q6  125.41,43.5 90 top
R1  30.48,25.4 0 top
R2  11.75,16.83 90 top
R3  15.56,16.83 90 top
R4  20.95,53.34 180 top
R5  13.65,81.91 0 top
R6  29.84,81.91 0 top
R7  46.36,81.91 0 top
R8  62.87,81.91 0 top
R9  79.69,81.91 0 top
R10  126.68,21.91 0 top
R11  119.7,21.91 0 top
R12  133.35,21.91 0 top
R13  130.81,49.85 0 top
R14  130.81,62.55 0 top
R15  7.62,16.83 270 top
R16  3.49,16.83 90 top
R18  27.3,16.83 90 top
R19  31.11,16.83 90 top
R21  130.81,37.78 0 top
R22  23.49,16.83 90 top
R23  19.37,16.83 90 top
R24  34.93,16.83 90 top
RXLED  15.56,9.52 90 top
SJ1  12.07,79.06 180 top
SJ2  12.07,76.52 180 top
SJ3  28.26,79.06 180 top
SJ4  28.26,76.52 180 top
SJ5  44.77,79.06 180 top
SJ6  44.77,76.52 180 top
SJ7  61.28,79.06 180 top
SJ8  61.28,76.52 180 top
SJ9  78.1,79.06 180 top
SJ10  78.1,76.52 180 top
SW1  49.85,13.97 90 top
SW2  41.28,13.97 270 top
TXLED  11.75,9.52 90 top
U$1  2.86,2.86 0 top
U$2  6.35,39.69 0 top
U$3  74.3,2.86 0 top
U$5  114.94,93.98 0 top
U$6  142.88,48.9 0 top
U$7  3.49,94.3 0 top
U$8  143.51,2.54 0 top
USBLED  7.62,9.52 90 top
VCCOK  3.49,9.52 90 top
VMOT  10.16,59.05 90 top
VREG1  121.6,43.5 90 top
VREG2  121.6,68.9 90 top
VREG3  121.6,56.2 90 top
VREG4  43.5,33.97 270 top
X1  14.29,39.69 0 top
X2  13.65,89.22 180 top
X3  29.84,89.22 180 top
X4  46.36,89.22 180 top
X5  24.45,131.13 0 top  (outside the outline)
X7  62.87,88.9 180 top
X8  79.38,88.9 180 top
XEND  92.39,92.07 0 top
XMOT1  17.14,92.07 0 top
XMOT2  9.84,92.07 0 top
XPOLOLU  18.41,83.18 270 top
YEND  100.01,92.07 0 top
YMOT1  33.66,92.07 0 top
YMOT2  26.35,92.07 0 top
YPOLOLU  34.93,83.18 270 top
ZEND  107.63,92.07 0 top
ZMOT1  50.16,92.07 0 top
ZMOT2  42.86,92.07 0 top
ZPOLOLU  51.44,83.18 270 top

### Tracks (layer width: path | path; a pad name or v marks a point on that pad's centre or on a via)
AVCC  (2 unrouted)
  Top 1.016: R11.1 118.3,21.72 116.52,23.5 116.52,26.04 | 116.52,26.04 116.52,26.35 | 116.52,26.35 116.52,26.99 | 116.52,26.99 116.52,28.89 | 116.52,28.89 121.6,28.89 | 121.6,28.89 123.19,28.89 | 123.19,28.89 130.17,28.89 130.17,23.5 131.44,22.23 | 131.44,22.23 131.76,21.91 | 131.76,21.91 132.08,21.91 131.76,21.91 | 131.76,21.91 131.44,22.23 | R10.1 125.1,21.91 123.51,23.5 123.51,28.57 123.19,28.89 | 116.52,28.89 116.52,26.99 | 116.52,26.99 116.52,26.35 | 116.52,26.35 116.52,26.99 | 116.52,26.99 C22.1 | C22.1 116.52,26.35 | C22.1 116.52,26.35 | 116.52,26.35 116.52,26.04 | L1.1 121.6,28.89
BEDADC  (1 unrouted)
  Top 1.016: C19.+ 127.95,22.04 R10.2 128.08,15.69 BEDTHERM.2
BEDMSFT  (via drill 0.6)  (2 unrouted)
  Top 0.406: BED.A 37,8.1 v37.47,8.57
  Bottom 0.61: v37.47,8.57 37.47,15.24 40.96,18.73 40.96,23.5
E1DIR
  Bottom 0.406: IC2.24 93.35,53.66 91.12,55.88 88.9,55.88 78.1,66.67 EPOLOLU2.DIR 71.76,66.67 70.17,65.09 57.79,65.09 EPOLOLU.DIR
E1SIG  (1 unrouted)
  Top 1.016: Q3.G 131.76,50.8 132.08,50.48 132.08,49.98 R13.2
E1STEP
  Top 0.406: EPOLOLU.STEP 56.2,68.58 58.74,66.04 61.91,66.04 63.82,64.13 79.06,64.13 80.96,62.23 80.96,59.37 86.99,53.34 86.99,50.48 87.95,49.53 90.17,49.53 90.8,50.16 IC2.25
E2SIG  (1 unrouted)
  Top 1.016: Q4.G 131.76,62.99 R14.2
E2STEP
  Top 0.406: EPOLOLU2.STEP 75.57,69.21 81.91,62.87 81.91,60.01 88.27,53.66 IC2.26
ENABLE  (via drill 0.6)  (1 unrouted)
  Top 0.61: 66.04,84.45 66.68,83.82 | 66.68,83.82 67.31,83.18 70.17,83.18 71.44,84.45 EPOLOLU2.EN | 34.29,83.18 37.47,83.18 38.73,84.45 ZPOLOLU.EN 49.85,84.45 51.12,83.18 54.29,83.18 55.56,84.45 EPOLOLU.EN 66.04,84.45 | 34.29,83.18 33.97,83.5 | 33.97,83.5 33.02,84.45 YPOLOLU.EN 22.22,84.45 20.95,83.18 18.42,83.18 17.15,84.45 XPOLOLU.EN | 33.97,83.5 34.29,83.18 | 66.04,84.45 66.68,83.82
  Top 1.016: R23.2 v19.37,22.54
  Bottom 1.016: v19.37,22.54 19.37,25.08 20.32,25.72 22.86,25.72 25.08,25.72 26.67,25.72 27.31,25.72 29.53,27.94 29.53,40.32 27.62,42.23 27.62,45.4 25.4,47.62 13.97,47.62 13.65,47.62 13.34,47.94 13.02,48.26 3.17,48.26 2.54,48.9 1.27,50.16 1.27,54.61 1.27,80.33 5.08,84.45 XPOLOLU.EN
EXT2ADC  (1 unrouted)
  Top 1.016: EXTTHERM2.2 134.75,15.69 R12.2 134.75,26.48 C21.+
EXTADC  (2 unrouted)
  Top 1.016: EXTTHERM.2 120.97,21.91 | R11.2 121.1,26.54 C20.+
EXTMSFT  (1 unrouted)
EXTMSFT2  (1 unrouted)
FANMSFT  (1 unrouted)
FANSIG  (2 unrouted)
  Top 1.016: 132.21,40.63 VREG1.1
  Top 1.27: VREG1.1 129.54,40.96 128.27,40.96 127.63,40.96
GND  (via drill 0.6)  (36 unrouted)
  Top 0.61: C13.2 22.99,88.13 v21.91,89.22 | C14.2 39.5,88.13 v38.42,89.22 | C15.2 56.01,87.82 v54.61,89.22 | C16.2 72.52,87.82 v71.12,89.22 | C17.2 88.71,87.82 v87.31,89.22 | 14.29,38.42 13.96,38.09 U$2.GND 8.56,38.09 6.67,36.2 6.67,33.66 5.71,32.7 4.45,32.7 3.81,32.07 3.81,30.61 C2.1 C1.2 3.81,26.86 3.81,25.08 v5.4,23.5 5.4,11.11 5.23,10.95 VCCOK.C USBLED.C | v16.83,44.13 16.83,45.72 18.1,46.99 18.73,46.99 | 18.73,46.99 19.05,46.67 IC1.20 | v34.93,20.96 R24.2 37.78,18.23 SW2.A SW2.A' 39.37,10.48 39.37,8.25 40.01,7.62 46.99,7.62 47.85,8.48 SW1.B' | SW1.B' SW1.B | 18.73,46.99 18.73,48.9 | 18.73,48.9 18.73,49.21 19.37,49.85 | C22.2 122.74,33.47 123.51,32.7 123.51,31.12 124.14,30.48 131.13,30.48 132.4,29.21 C21.- | VMOT.1 10.48,55.56 3.81,55.56 1.9,53.66 1.9,50.48 3.49,48.9 18.73,48.9 | SW1.B' 47.85,18.96 48.9,20 63.82,20 65.41,18.41 JP6.6
  Top 1.016: EXTTHERM.1 118.43,13.97 119.06,13.34 119.38,13.02 125.41,13.02 | 125.41,13.02 131.44,13.02 132.08,13.65 EXTTHERM2.1 | BEDTHERM.1 125.41,13.02 | 14.29,38.42 X1.GND | J2.6 36.85,38.12 VREG4.1 36.14,35.56 35.88,35.56 v33.02,32.07
  Top 1.27: EPOLOLU2.GND 82.74,66.67 C12.2 | C11.2 68.71,66.86 EPOLOLU.GND | C10.2 52.52,66.86 ZPOLOLU.GND | C9.2 36.01,66.86 YPOLOLU.GND | C8.2 19.5,66.86 XPOLOLU.GND | VREG1.3 131.88,46.48 132.08,46.67 132.08,46.36 132.4,46.04
  Bottom 0.61: v21.91,89.22 21.91,89.85 | v38.42,89.22 38.42,89.85 | v54.61,89.22 54.61,89.85 | v71.12,89.22 71.12,89.53 71.12,89.85 | v87.31,89.22 87.31,89.85 | X1.GND 13.95,38.44 12.7,39.69 12.7,42.86 13.65,43.81 16.51,43.81 v16.83,44.13 | v34.93,20.96 34.93,21.91 34.93,22.23 29.53,22.23 29.53,20.32 23.81,20.32 23.81,24.13 20.95,24.13 20.95,20.96 10.16,20.96 8.89,19.69 5.4,19.69 v5.4,23.5 | C20.- 118.43,25.08 119.06,24.45 125.1,24.45 | 125.1,24.45 131.44,24.45 | 131.44,24.45 131.76,24.45 132.4,25.08 C21.- | C19.- 125.41,24.77 125.1,24.45 | EXTTHERM2.1 132.08,23.81 131.44,24.45
  Bottom 1.016: 34.93,22.23 34.93,29.21 v33.02,32.07
MCRTS
  Top 0.61: IC1.11 30.48,48.26 30.16,48.58 30.16,49.53 30.16,49.85 C7.2
MCRX
  Top 0.406: IC1.12 29.21,47.31 27.94,48.58 27.94,51.12 28.58,51.75 34.29,51.75 34.93,51.12 38.73,51.12 40.64,49.21 48.26,49.21 48.9,48.58 52.39,48.58 55.88,45.09 56.51,45.09 56.83,45.4 58.74,45.4 59.05,45.09 59.05,44.45 59.69,43.81 66.99,43.81 68.9,41.91 84.46,41.91 88.27,38.1 IC2.15
MCTX  (via drill 0.6)
  Top 0.61: IC1.10 31.04,35.01 v32.07,33.97
  Bottom 0.406: 38.1,33.97 84.46,33.97 85.72,35.24 IC2.14
  Bottom 0.61: v32.07,33.97 38.1,33.97
MCURESET  (via drill 0.6)  (1 unrouted)
  Top 0.406: IC2.9 73.02,38.1 71.12,40.01 67.94,40.01 66.04,41.91 57.79,41.91 52.07,47.62 48.58,47.62 47.94,48.26 43.18,48.26 41.59,46.67 J2.5 37.15,49.85 C7.1 33.02,49.66 v33.02,45.72 | R4.1 24.13,53.34 v25.72,51.75
  Top 0.61: JP6.5 65.72,11.94 65.72,8.25 64.77,7.3 53.34,7.3 51.85,8.8 SW1.A SW1.A'
  Bottom 0.406: v25.72,51.75 v33.02,45.72
MISO  (1 unrouted)
  Top 0.406: IC2.7 67.94,36.83 67.94,38.1 67.63,38.1 66.68,38.1 64.77,40.01 56.51,40.01 51.12,45.4 J2.1
MOSI  (1 unrouted)
  Top 0.406: J2.4 44.13,42.55 44.13,41.59 45.08,40.64 50.48,40.64 51.43,41.59 51.75,41.91 53.02,41.91 55.88,39.05 64.14,39.05 65.41,37.78 IC2.6
N$1
  Top 0.61: IC1.2 20.32,32.7 17.78,30.16 13.27,30.16 Q1.1 9.97,27.94 C2.2
N$2
  Top 0.61: C1.1 5.71,26.99 7.3,25.4 14.6,25.4 16.51,27.3 16.51,27.94 16.83,28.26 18.73,28.26 | 18.73,28.26 20.38,28.26 Q1.2 | IC1.3 21.59,31.12 18.73,28.26
N$3
  Top 0.61: IC1.5 24.13,26.04 23.49,25.4 16.51,25.4 14.6,23.5 13.02,23.5 11.75,22.23 R2.2
N$4
  Top 0.61: U$2.D- 11.28,40.49 13.34,42.55 15.87,42.55 16.19,42.23 16.19,41.01 X1.D- 19.03,40.94 21.59,43.5 IC1.18
N$5  (via drill 0.6)
  Top 0.61: U$2.D+ 13.04,39.69 X1.D+ | IC1.19 20.32,44.13 v18.73,42.55
  Bottom 0.61: v18.73,42.55 15.9,42.55 X1.D+
N$6
  Top 0.61: IC1.6 25.4,25.4 24.13,24.13 17.15,24.13 15.56,22.54 R3.2
N$7
  Top 0.61: IC1.17 22.86,49.34 C3.2
N$9
  Top 0.61: R2.1 11.75,11.11 | 11.75,11.11 TXLED.C | TXLED.C 11.75,10.8 TXLED.C | TXLED.C 11.75,11.11 | TXLED.C 11.75,11.11
N$10
  Top 0.61: RXLED.C R3.1
N$11  (2 unrouted)
N$12  (2 unrouted)
N$13  (via drill 0.6)
  Top 0.61: SW2.B' SW2.B 43.18,17.46 43.18,19.69 42.54,20.32 37.15,20.32 36.51,20.96 36.51,21.59 36.51,25.72 34.93,27.3 29.21,27.3 | IC1.4 22.86,37.47 23.49,38.1 26.04,38.1 v27.31,39.37 | v27.31,30.16 27.31,27.3 | 27.31,27.3 27.31,26.35 28.26,25.4 28.89,25.4 | 29.21,27.3 27.31,27.3 | R1.1 29.08,27.18 29.21,27.3
  Bottom 0.61: v27.31,39.37 v27.31,30.16
N$14
  Top 0.61: ZPOLOLU.MS1 R7.1 45.28,81.59 SJ5.1 SJ6.1
N$15
  Top 0.61: SJ6.2 40.64,76.52 ZPOLOLU.MS3
N$16
  Top 0.61: SJ5.2 40.64,79.06 ZPOLOLU.MS2
N$17
  Top 0.61: SJ7.2 56.83,79.06 EPOLOLU.MS2
N$18
  Top 0.61: SJ8.2 56.83,76.52 EPOLOLU.MS3
N$19
  Top 0.61: SJ8.1 SJ7.1 61.79,81.59 R8.1 EPOLOLU.MS1
N$20
  Top 0.61: SJ3.2 23.81,79.06 YPOLOLU.MS2
N$21
  Top 0.61: SJ4.2 23.81,76.52 YPOLOLU.MS3
N$22
  Top 0.61: YPOLOLU.MS1 R6.1 28.77,81.59 SJ3.1 SJ4.1
N$23
  Top 0.61: SJ1.2 7.3,79.06 XPOLOLU.MS2
N$24
  Top 0.61: SJ2.2 7.3,76.52 XPOLOLU.MS3
N$25  (1 unrouted)
  Top 0.61: R5.1 XPOLOLU.MS1 | 12.7,81.28 12.57,81.15 SJ1.1 SJ2.1
N$26
  Bottom 0.61: XPOLOLU.RST XPOLOLU.SLP
N$27
  Bottom 0.61: YPOLOLU.RST YPOLOLU.SLP
N$28
  Bottom 0.61: ZPOLOLU.RST ZPOLOLU.SLP
N$29
  Bottom 0.61: EPOLOLU.RST EPOLOLU.SLP
N$30
  Bottom 1.27: E1MOT1.1 X7.1 66.68,81.6 EPOLOLU.2B
N$31
  Bottom 1.27: E1MOT1.2 X7.2 64.14,81.6 EPOLOLU.2A
N$32
  Bottom 1.27: E1MOT2.1 X7.3 61.6,81.6 EPOLOLU.1A
N$33
  Bottom 1.27: E1MOT2.2 X7.4 59.05,81.6 EPOLOLU.1B
N$34
  Bottom 1.27: ZMOT2.2 X4.4 42.54,81.91 ZPOLOLU.1B
N$35
  Bottom 1.27: ZMOT2.1 X4.3 45.08,81.91 ZPOLOLU.1A
N$36
  Bottom 1.27: ZMOT1.2 X4.2 47.62,81.91 ZPOLOLU.2A
N$37
  Bottom 1.27: ZMOT1.1 X4.1 50.16,81.91 ZPOLOLU.2B
N$38
  Bottom 1.27: YMOT2.2 X3.4 26.04,81.91 YPOLOLU.1B
N$39
  Bottom 1.27: YMOT2.1 X3.3 28.58,81.91 YPOLOLU.1A
N$40
  Bottom 1.27: YMOT1.2 X3.2 31.11,81.91 YPOLOLU.2A
N$41
  Bottom 1.27: YMOT1.1 X3.1 33.65,81.91 YPOLOLU.2B
N$42
  Bottom 1.27: XMOT2.2 X2.4 9.84,81.6 XPOLOLU.1B
N$43
  Bottom 1.27: XMOT2.1 X2.3 12.38,81.6 XPOLOLU.1A
N$44
  Bottom 1.27: XMOT1.2 X2.2 14.92,81.6 XPOLOLU.2A
N$45
  Bottom 1.27: XMOT1.1 X2.1 17.46,81.6 XPOLOLU.2B
N$46
  Top 0.61: SJ9.2 73.66,79.06 EPOLOLU2.MS2
N$47
  Top 0.61: SJ10.2 73.98,76.52 EPOLOLU2.MS3
N$48
  Top 0.61: SJ10.1 SJ9.1 78.61,81.59 R9.1 EPOLOLU2.MS1
N$49
  Bottom 0.61: EPOLOLU2.RST EPOLOLU2.SLP
N$50
  Bottom 1.27: E2MOT1.1 X8.1 83.19,81.91 EPOLOLU2.2B
N$51
  Bottom 1.27: E2MOT1.2 X8.2 80.65,81.91 EPOLOLU2.2A
N$52
  Bottom 1.27: E2MOT2.1 X8.3 78.1,81.91 EPOLOLU2.1A
N$53
  Bottom 1.27: E2MOT2.2 X8.4 75.57,81.91 EPOLOLU2.1B
N$54  (1 unrouted)
N$55  (via drill 0.6)  (1 unrouted)
  Top 0.61: E1LED.C v27.31,13.02
  Top 1.93: VREG3.2 Q3.D | Q3.D 137.48,56.2 | 137.48,56.2 137.84,56.2 EXT1HEATER.1 139.1,58.06 D1.A | Q3.D 137.48,56.2
  Bottom 0.61: v27.31,13.02 27.31,16.83 28.58,18.1 36.51,18.1 38.42,20 38.42,23.5
N$56  (via drill 0.6)  (1 unrouted)
  Top 0.61: E2LED.C v31.11,13.02
  Top 1.93: VREG2.2 Q4.D | Q4.D 137.52,68.9 | 137.52,68.9 EXT2HEATER.1 138.79,71.08 D2.A | Q4.D 137.52,68.9
  Bottom 0.61: v31.11,13.02 31.11,15.24 32.7,16.83 37.15,16.83 39.69,19.37 39.69,23.5
N$58  (via drill 0.6)  (1 unrouted)
  Top 0.61: IC1.1 19.05,36.51 17.15,38.42 16.29,38.42 X1.VBUS | v6.35,43.5 6.64,43.5 U$2.VBUS | v7.62,21.27 R15.1
  Bottom 0.61: 11.11,42.23 10.79,42.55 | 7.3,42.55 v6.35,43.5
  Bottom 1.016: X1.VBUS 16.27,37.54 14.92,36.2 13.97,36.2 | 13.97,36.2 11.11,39.05 11.11,42.23 | 10.79,42.55 7.3,42.55 | 13.97,36.2 13.97,27.62 11.75,25.4 | 11.75,25.4 v7.62,21.27 | JP1.1 48.08,19.82 46.99,18.73 46.99,6.67 44.77,4.45 20.32,4.45 18.42,6.35 18.42,15.88 16.51,17.78 4.76,17.78 3.49,19.05 3.49,24.45 4.45,25.4 11.75,25.4
N$59
  Top 0.61: BED.C R24.1
N$61
  Top 0.61: E1LED.A 26.19,8.1 25.4,8.89 25.4,14.92 26.04,15.56 27.18,15.56 R18.1
N$64  (1 unrouted)
  Top 0.61: VCCOK.A 2.69,8.1 1.9,8.89 1.9,15.24 2.22,15.56 2.86,15.56 3.17,15.24 3.49,15.24 | 3.49,15.24 3.49,15.56 3.49,15.24
N$66
  Top 0.61: E2LED.A 30,8.1 29.21,8.89 29.21,14.61 30.16,15.56 30.99,15.56 R19.1
N$67  (via drill 0.6)  (1 unrouted)
  Top 0.61: 23.49,9.52 FANLED.C v23.49,13.02
  Top 1.93: VREG1.2 Q6.D | Q6.D 137.84,43.5 | 137.84,43.5 FAN.1 139.1,45.36 D6.A | Q6.D 137.84,43.5
  Bottom 0.61: v23.49,13.02 23.49,15.56 27.31,19.37 35.88,19.37 37.15,20.64 37.15,23.5
N$68
  Top 0.61: R15.2 8.7,15.43 9.52,14.61 9.52,8.89 8.89,8.25 7.77,8.25 USBLED.A
N$69
  Top 0.61: FANLED.A 22.06,8.1 21.27,8.89 21.27,14.92 21.91,15.56 23.36,15.56 R22.1
N$71
  Top 0.61: ENABLE.C R23.1
SCK  (1 unrouted)
  Top 0.406: IC2.8 70.49,38.1 69.53,39.05 67.31,39.05 65.41,40.96 57.15,40.96 51.43,46.67 48.26,46.67 47.62,47.31 44.77,47.31 44.13,46.67 J2.3
SCL  (1 unrouted)
SDA  (1 unrouted)
SDS  (1 unrouted)
VCC  (via drill 0.6)  (4 unrouted)
  Top 0.406: IC2.10 75.57,38.1 72.71,40.96 68.58,40.96 66.68,42.86 59.05,42.86 v57.79,44.13 | R4.2 19.56,56.65 11.43,64.77 6.35,64.77 5.08,66.04 5.08,70.17 5.4,70.48 18.42,70.48
  Top 0.61: 84.46,70.48 EPOLOLU2.VDD 84.46,70.48 | 84.46,70.48 82.23,70.48 | 82.23,70.48 67.63,70.48 | 67.63,70.48 EPOLOLU.VDD 67.63,70.48 | 67.63,70.48 65.72,70.48 | 65.72,70.48 49.21,70.48 | 49.21,70.48 32.7,70.48 | 32.7,70.48 32.07,70.48 | 32.07,70.48 31.11,70.48 | 31.11,70.48 18.42,70.48 | 18.42,70.48 XPOLOLU.VDD 18.42,70.48 | 18.42,70.48 31.11,70.48 | 31.11,70.48 32.07,70.48 | 32.07,70.48 32.7,70.48 | 32.7,70.48 49.21,70.48 | 49.21,70.48 51.43,70.48 | 51.43,70.48 ZPOLOLU.VDD 51.43,70.48 | 51.43,70.48 49.21,70.48 | 49.21,70.48 34.93,70.48 | 34.93,70.48 YPOLOLU.VDD 34.93,70.48 | 34.93,70.48 32.7,70.48 | 32.7,70.48 32.07,70.48 | 32.07,70.48 31.11,70.48 | R6.2 31.24,74.16 34.93,70.48 | R7.2 47.76,74.16 51.43,70.48 | R5.2 15.05,73.85 18.42,70.48 | R8.2 64.26,73.85 67.63,70.48 | R9.2 81.09,73.85 84.46,70.48 | 18.42,70.48 17.33,70.48 C8.1 | C12.1 82.55,70.17 82.23,70.48 | 82.23,70.48 84.46,70.48 | C11.1 65.72,70.48 | C10.1 49.53,70.17 49.21,70.48 | C9.1 33.02,70.17 32.7,70.48 | ENABLE.A RXLED.A TXLED.A 10.64,8.1 8.89,6.35 2.22,6.35 0.95,7.62 0.95,17.14 1.9,18.1 3.36,18.1 R16.2 | ENABLE.A 19.37,7.94 | 19.37,7.94 v20.64,6.67 19.37,7.94 | ENABLE.A 19.37,7.94 | v22.22,22.54 25.4,22.54 26.04,23.18 27.94,23.18 28.58,22.54 31.11,22.54 31.75,23.18 31.75,25.27 R1.2 | JP1.2 50.8,24.45 50.8,23.18 49.85,22.23 48.58,22.23 46.99,20.64 46.67,20.64 45.4,20.64 45.4,9.84 v45.08,9.52
  Top 1.016: v43.5,38.73 VREG4.2 45.08,32.38 48.26,32.38 50.8,29.84 50.8,24.45
  Bottom 0.406: v57.79,44.13 49.85,44.13 48.58,42.86 46.99,42.86 J2.2
  Bottom 0.61: v22.22,22.54 22.22,22.23 22.22,20.32 20.64,18.73 v20.64,6.67 21.59,5.72 44.13,5.72 45.08,6.67 v45.08,9.52
  Bottom 1.016: J2.2 46.67,41.91 v43.5,38.73
VMOT  (via drill 0.6)  (17 unrouted)
  Top 0.61: R19.2 R18.2 R22.2 23.63,18.23 v26.99,21.59
  Top 1.016: v33.02,29.21 33.02,29.53 34.93,31.43 36.83,31.43 36.85,31.45 VREG4.3
  Bottom 0.61: v26.99,21.59 28.26,22.54 29.53,23.81 29.53,25.4 30.8,26.67 30.8,40.96 28.89,42.86 28.89,46.04 26.04,48.9 14.6,48.9 13.65,49.85 3.81,49.85 2.54,51.12 2.54,54.29 2.54,60.64 3.49,61.6 8.57,61.6 VMOT.2
  Bottom 1.016: 30.8,26.67 30.8,26.99 v33.02,29.21
XDIR
  Bottom 0.406: XPOLOLU.DIR 11.11,66.67 15.24,62.55 21.91,55.88 58.1,55.88 60.33,53.66 IC2.37
XEND  (1 unrouted)
  Bottom 0.61: IC2.1 52.71,41.59 53.66,42.55
XSTEP
  Top 0.406: XPOLOLU.STEP 6.99,68.58 8.89,66.67 11.11,66.67 21.91,55.88 55.56,55.88 57.79,53.66 IC2.38
YDIR
  Bottom 0.406: YPOLOLU.DIR 23.49,59.69 26.35,56.83 61.28,56.83 65.41,52.7 IC2.35
YEND  (1 unrouted)
YSTEP
  Top 0.406: YPOLOLU.STEP 24.13,69.21 25.4,67.94 25.4,66.36 23.49,64.45 23.49,59.69 26.35,56.83 59.05,56.83 62.86,53.02 IC2.36
ZDIR
  Bottom 0.406: ZPOLOLU.DIR 40.01,59.69 41.91,57.79 78.74,57.79 83.19,53.34 IC2.28
ZEND  (1 unrouted)
ZSTEP
  Top 0.406: ZPOLOLU.STEP 40.96,69.21 41.91,68.26 41.91,65.72 40.01,63.82 40.01,59.69 41.91,57.79 75.88,57.79 80.65,53.02 IC2.29

### Text on the board
OPENHWSILK: X | Y | Z | E1 | E2 | + | - | USB=1/PSU=0 | RESET | USB | PSU | USB | TX | RX | MOTORS | FAN | H/END1 | H/END2 | HEATBED | Reset